# EAGLE design Lock-In (EAGLE 7.5.0)
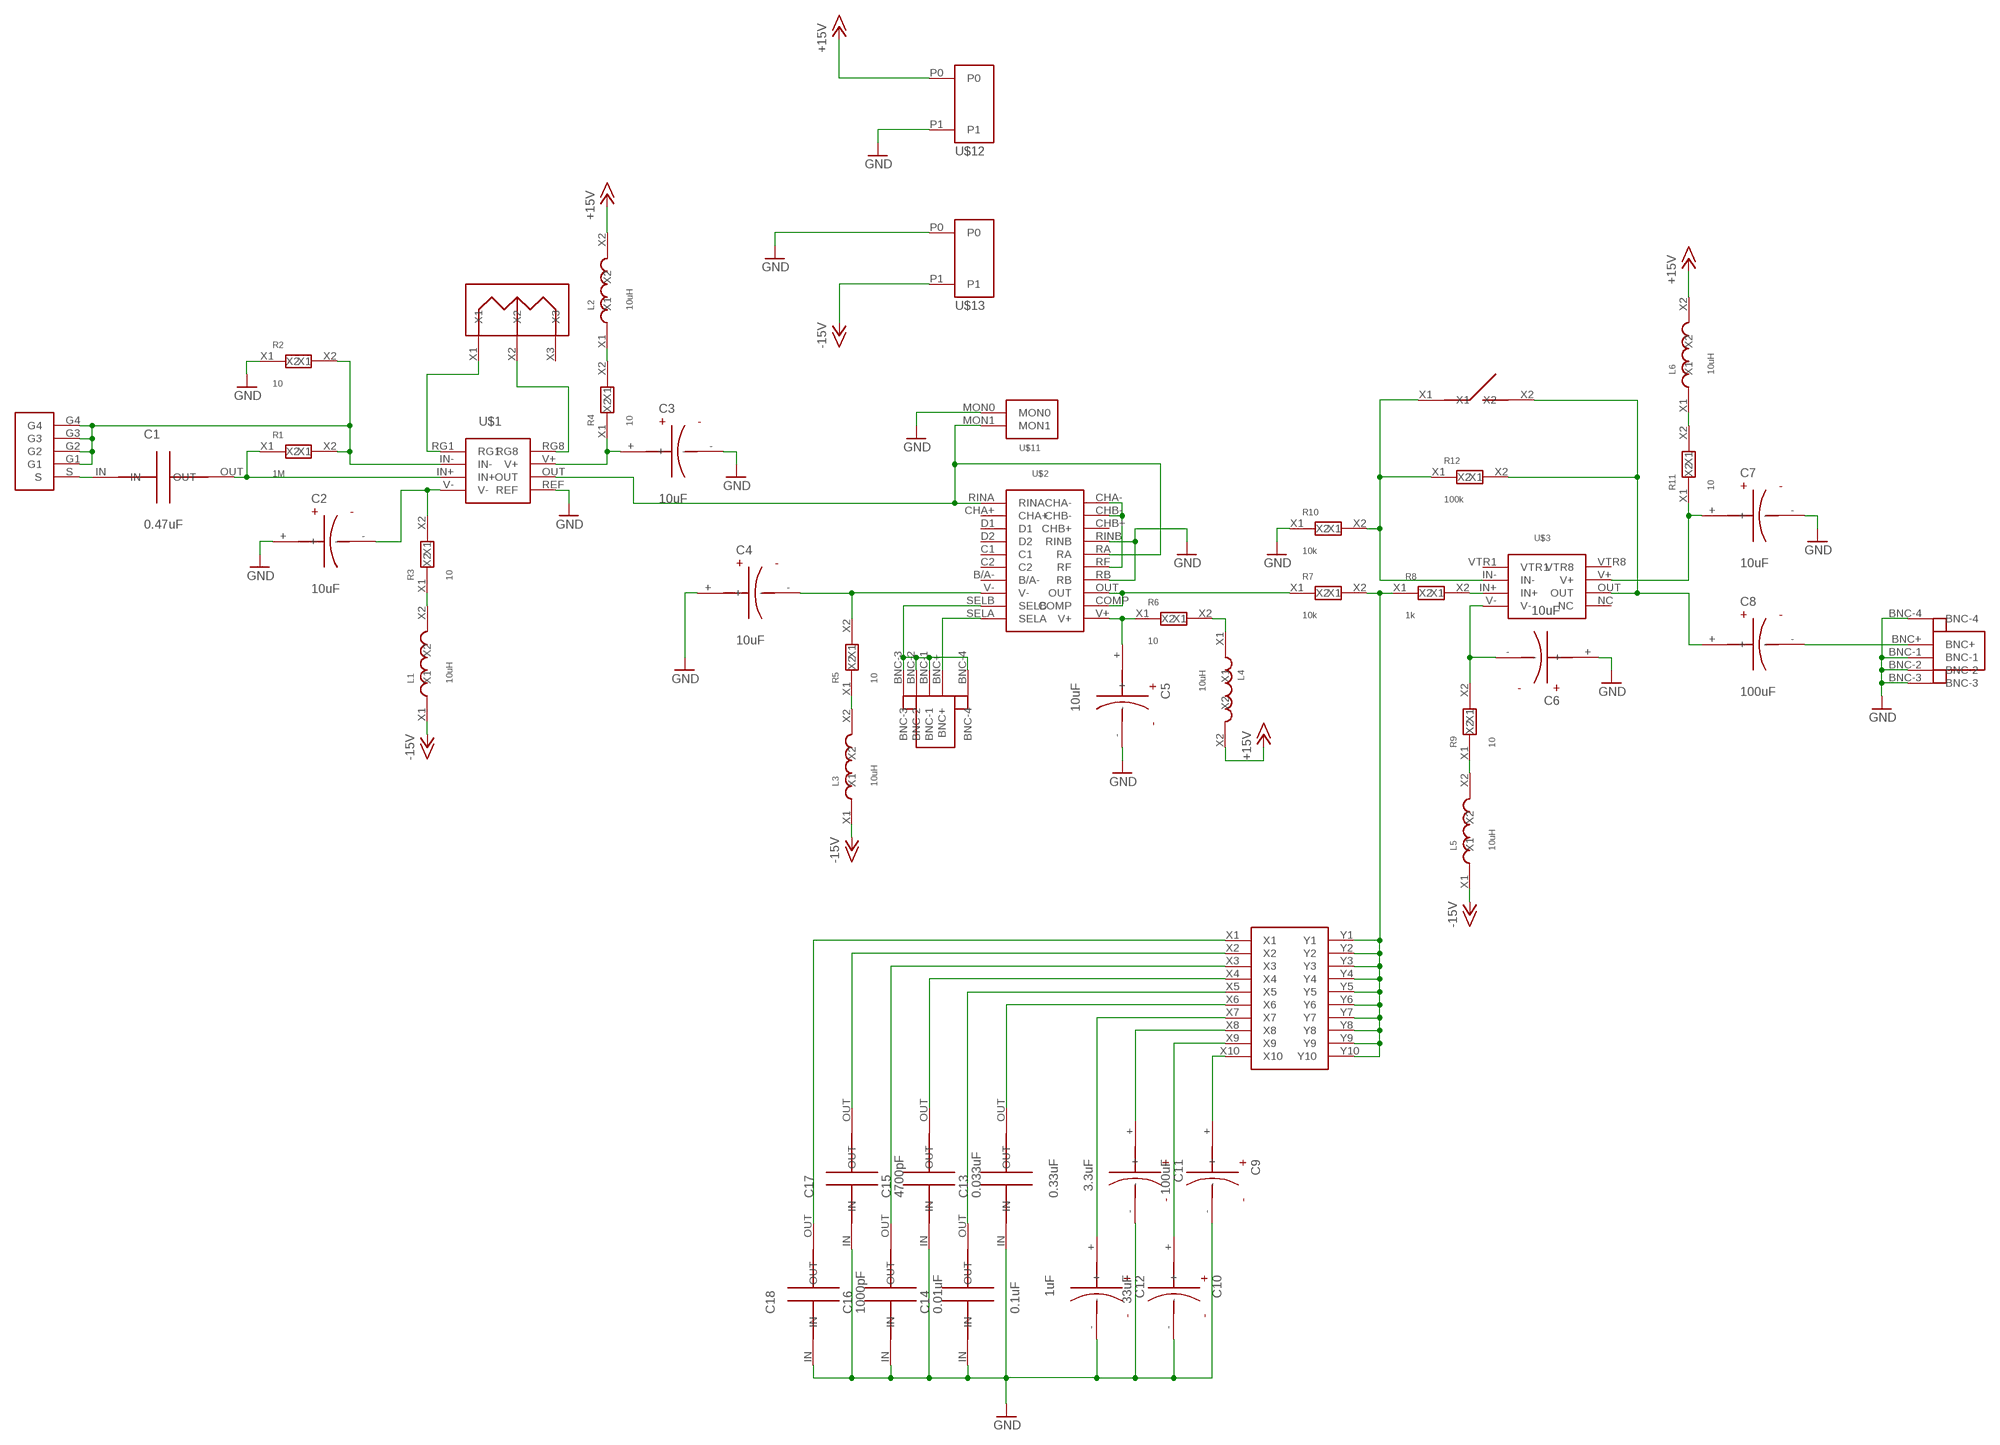
[diagram p0: schematic, sheet 1]

## Parts
C1  0.47uF  C_CER_5MM  [C_CER_5MM]
C2  10uF  C_ELT_2MM  [C_ELT_2MM]
C3  10uF  C_ELT_2MM  [C_ELT_2MM]
C4  10uF  C_ELT_2MM  [C_ELT_2MM]
C5  10uF  C_ELT_2MM  [C_ELT_2MM]
C6  10uF  C_ELT_2MM  [C_ELT_2MM]
C7  10uF  C_ELT_2MM  [C_ELT_2MM]
C8  100uF  C_ELT_2MM  [C_ELT_2MM]
C9  100uF  C_ELT_2MM  [C_ELT_2MM]
C10  33uF  C_ELT_2MM  [C_ELT_2MM]
C11  3.3uF  C_ELT_2MM  [C_ELT_2MM]
C12  1uF  C_ELT_2MM  [C_ELT_2MM]
C13  0.33uF  C_CER_5MM  [C_CER_5MM]
C14  0.1uF  C_CER_5MM  [C_CER_5MM]
C15  0.033uF  C_CER_5MM  [C_CER_5MM]
C16  0.01uF  C_CER_5MM  [C_CER_5MM]
C17  4700pF  C_CER_5MM  [C_CER_5MM]
C18  1000pF  C_CER_5MM  [C_CER_5MM]
L1  10uH  L_10X3  [L_10X3]
L2  10uH  L_10X3  [L_10X3]
L3  10uH  L_10X3  [L_10X3]
L4  10uH  L_10X3  [L_10X3]
L5  10uH  L_10X3  [L_10X3]
L6  10uH  L_10X3  [L_10X3]
R1  1M  R_6X2  [R_6X2]
R2  10  R_6X2  [R_6X2]
R3  10  R_6X2  [R_6X2]
R4  10  R_6X2  [R_6X2]
R5  10  R_6X2  [R_6X2]
R6  10  R_6X2  [R_6X2]
R7  10k  R_6X2  [R_6X2]
R8  1k  R_6X2  [R_6X2]
R9  10  R_6X2  [R_6X2]
R10  10k  R_6X2  [R_6X2]
R11  10  R_6X2  [R_6X2]
R12  100k  R_6X2  [R_6X2]
U$1  AD620N  [AD620N]
U$2  AD630  [AD630]
U$3  OP27  [OP27]
U$4  BNC  [BNC]
U$5  BNC  [BNC]
U$6  DIP10  [DIP10]
U$7  R_VAR_10K  [R_VAR_10K]
U$8  SMA_AN  [SMA_AN]
U$9  DIP_1  [DIP_1]
U$11  MON2PIN  [MON2PIN]
U$12  RAIL_2  [RAIL_2]
U$13  RAIL_2  [RAIL_2]

## Nets
+15V: L2.X2 L4.X2 L6.X2 U$12.P0
-15V: L1.X1 L3.X1 L5.X1 U$13.P1
GND: C2.+ C3.- C4.+ C5.- C6.+ C7.- C9.- C10.- C11.- C12.- C13.IN C14.IN C15.IN C16.IN C17.IN C18.IN R2.X1 R10.X1 U$1.REF U$2.RB U$2.RINB U$5.BNC-1 U$5.BNC-2 U$5.BNC-3 U$5.BNC-4 U$11.MON0 U$12.P1 U$13.P0
N$1: C1.IN U$8.S
N$2: R1.X2 R2.X2 U$1.IN- U$8.G1 U$8.G2 U$8.G3 U$8.G4
N$3: C1.OUT R1.X1 U$1.IN+
N$5: L1.X2 R3.X1
N$6: C2.- R3.X2 U$1.V-
N$7: C3.+ R4.X1 U$1.V+
N$8: U$1.RG1 U$7.X1
N$9: U$1.RG8 U$7.X2
N$10: L2.X1 R4.X2
N$11: U$1.OUT U$2.RA U$2.RINA U$11.MON1
N$12: R7.X1 U$2.COMP U$2.OUT
N$13: U$2.CHA- U$2.CHB- U$2.RF
N$14: U$2.SELA U$4.BNC+
N$15: U$2.SELB U$4.BNC-1 U$4.BNC-2 U$4.BNC-3 U$4.BNC-4
N$16: C5.+ R6.X1 U$2.V+
N$17: L4.X1 R6.X2
N$18: L3.X2 R5.X1
N$19: C4.- R5.X2 U$2.V-
N$20: R7.X2 R8.X1 U$6.Y1 U$6.Y2 U$6.Y3 U$6.Y4 U$6.Y5 U$6.Y6 U$6.Y7 U$6.Y8 U$6.Y9 U$6.Y10
N$21: R8.X2 U$3.IN+
N$22: L5.X2 R9.X1
N$23: C6.- R9.X2 U$3.V-
N$24: R10.X2 R12.X1 U$3.IN- U$9.X1
N$25: C7.+ R11.X1 U$3.V+
N$26: L6.X1 R11.X2
N$27: C8.+ R12.X2 U$3.OUT U$9.X2
N$28: C8.- U$5.BNC+
N$29: C9.+ U$6.X10
N$30: C10.+ U$6.X9
N$31: C11.+ U$6.X8
N$32: C12.+ U$6.X7
N$34: C13.OUT U$6.X6
N$35: C14.OUT U$6.X5
N$36: C15.OUT U$6.X4
N$37: C16.OUT U$6.X3
N$38: C17.OUT U$6.X2
N$39: C18.OUT U$6.X1
Unconnected: U$2.B/A- U$2.C1 U$2.C2 U$2.CHA+ U$2.CHB+ U$2.D1 U$2.D2 U$3.NC U$3.VTR1 U$3.VTR8 U$7.X3

## Library data of the parts
C1 C13-C18 = MyDuino:C_CER_5MM
C2-C12 = MyDuino:C_ELT_2MM
L1-L6 = MyDuino:L_10X3
R1-R12 = MyDuino:R_6X2
U$1 = MyLockIn:AD620N
U$2 = MyLockIn:AD630
U$3 = MyLockIn:OP27
U$4 U$5 = MyLockIn:BNC
U$6 = MyLockIn:DIP10
U$7 = MyLockIn:R_VAR_10K
U$8 = My_OPT:SMA_AN
U$9 = My_STM32L15x:DIP_1
U$11 = MyCMOSsensor:MON2PIN
U$12 U$13 = My_HV_Components:RAIL_2

## Board
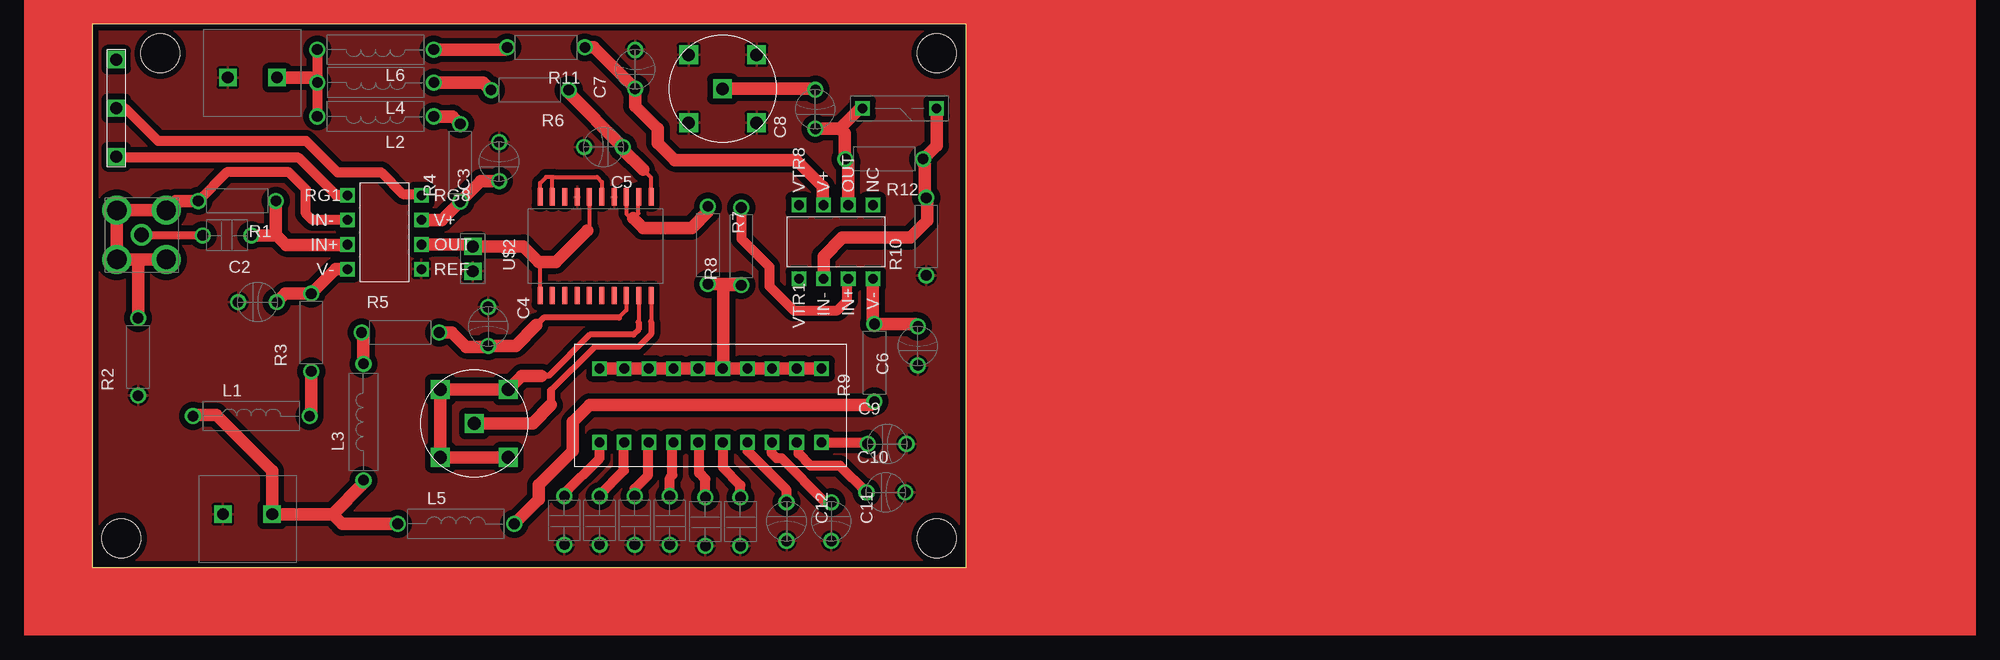
[diagram p1: board, top side]
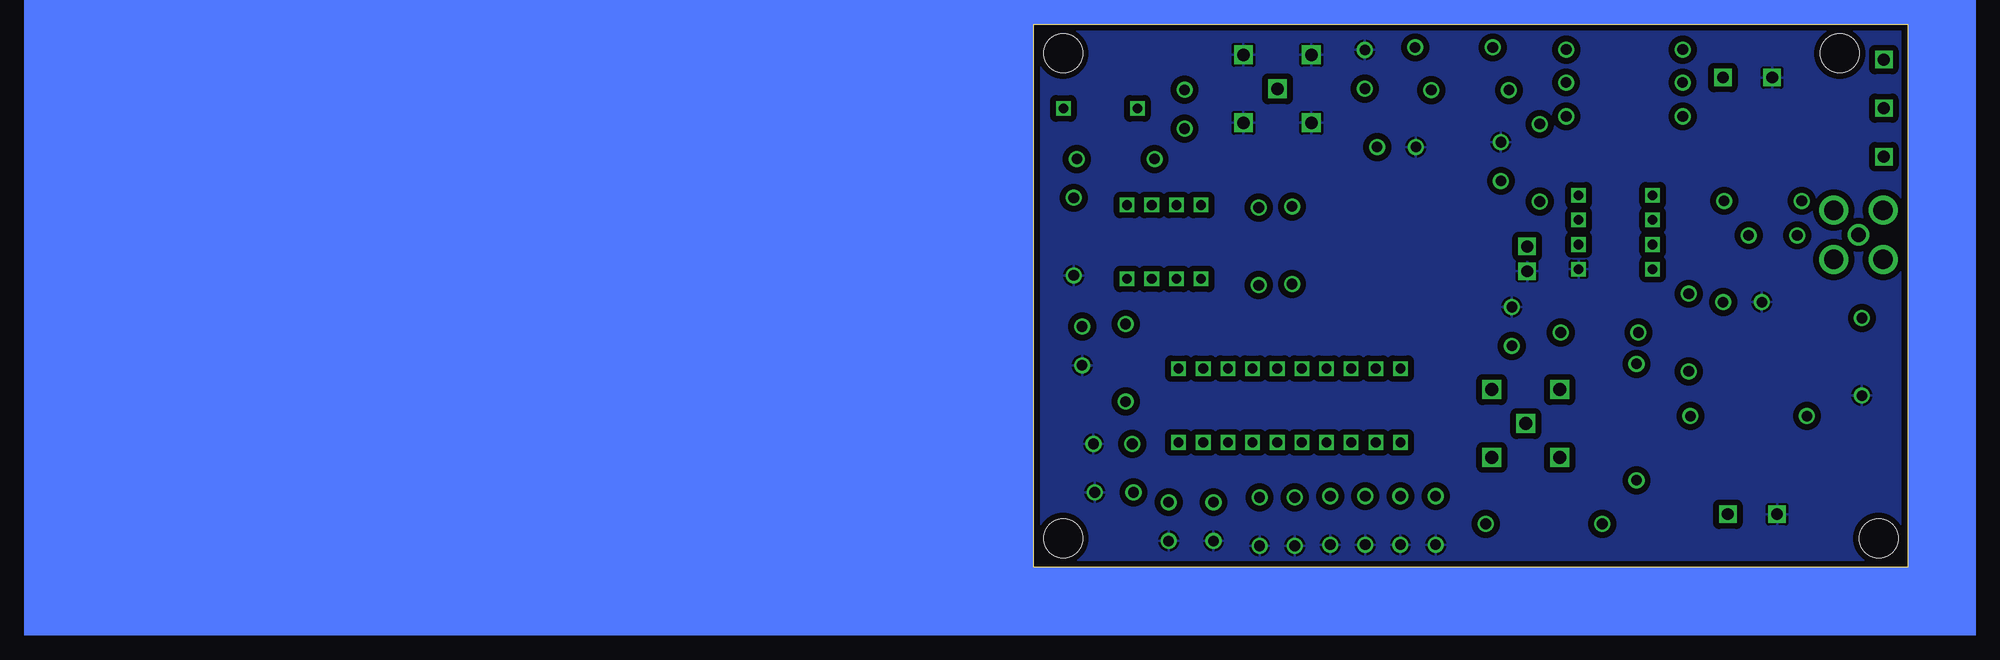
[diagram p2: board, bottom side, seen from below]

Size 90 x 56 mm. Coordinates in mm from the lower left corner, seen from the top.
Outline: 0,0 90,0 90,56 0,56 0,0
Copper layers (1*16): Top 0.035mm / dielectric 1.5mm / Bottom 0.035mm
Design rules "default *": minimum track width 10mil, minimum drill 24mil, track to track 8mil, track to pad 8mil, pad to pad 8mil, via to via 8mil, smd to smd 8mil, copper to edge 10mil, drill to drill 8mil, minimum pad ring 10mil, minimum via ring 8mil, stop-mask expansion 4mil, vias tented up to drill 0mil, thermal gap 10mil
Holes 4 mm at 7,53 87,53 87,3 3,3

### Footprints (pad centres in the part's own frame; a part is rotated, then mirrored left to right if it is on the bottom)
C_CER_5MM = drill 1.1: IN -2.5,0; OUT 2.5,0
C_ELT_2MM = drill 1.1: + -2,0; - 2,0
L_10X3 = drill 1.1: X1 -6,0; X2 6,0
R_6X2 = drill 1.1: X1 -4,0; X2 4,0
AD620N = drill 1 square: IN+ -5.08,0; IN- -5.08,2.54; OUT 2.54,0; REF 2.54,-2.54; RG1 -5.08,5.08; RG8 2.54,5.08; V+ 2.54,2.54; V- -5.08,-2.54
AD630 = smd 1.778 x 0.508: B/A- -5.08,-1.27; C1 -5.08,1.27; C2 -5.08,0; CHA+ -5.08,5.08; CHA- 5.08,6.35; CHB+ 5.08,3.81; CHB- 5.08,5.08; COMP 5.08,-3.81; D1 -5.08,3.81; D2 -5.08,2.54; OUT 5.08,-2.54; RA 5.08,1.27; RB 5.08,-1.27; RF 5.08,0; RINA -5.08,6.35; RINB 5.08,2.54; SELA -5.08,-5.08; SELB -5.08,-3.81; V+ 5.08,-5.08; V- -5.08,-2.54
OP27 = drill 1 square: IN+ -2.54,0; IN- -2.54,2.54; NC 5.08,-2.54; OUT 5.08,0; V+ 5.08,2.54; V- -2.54,-2.54; VTR1 -2.54,5.08; VTR8 5.08,5.08
BNC = drill 1.3 square: BNC+ 0,0; BNC-1 -3.5,3.5; BNC-2 3.5,3.5; BNC-3 3.5,-3.5; BNC-4 -3.5,-3.5
DIP10 = drill 1 square: X1 -5.08,12.7; X2 -5.08,10.16; X3 -5.08,7.62; X4 -5.08,5.08; X5 -5.08,2.54; X6 -5.08,0; X7 -5.08,-2.54; X8 -5.08,-5.08; X9 -5.08,-7.62; X10 -5.08,-10.16; Y1 2.54,12.7; Y2 2.54,10.16; Y3 2.54,7.62; Y4 2.54,5.08; Y5 2.54,2.54; Y6 2.54,0; Y7 2.54,-2.54; Y8 2.54,-5.08; Y9 2.54,-7.62; Y10 2.54,-10.16
R_VAR_10K = drill 1.2 square: X1 0,5; X2 0,0; X3 0,-5
SMA_AN = drill 2: G1 -2.54,2.54; G2 2.54,2.54; G3 2.54,-2.54; G4 -2.54,-2.54 | drill 1.5: S 0,0
DIP_1 = drill 1 square: X1 0,2.54; X2 0,-5.08
MON2PIN = drill 1.2 square: MON0 0,2.54; MON1 0,0
RAIL_2 = drill 1.2 square: P0 0,2.54; P1 0,-2.54

### Placement (x,y rotation side)
C1  13.89,34.24 0 top
C2  17.02,27.35 0 top
C3  41.9,41.85 90 top
C4  40.78,24.85 270 top
C5  52.66,43.35 180 top
C6  85.04,22.85 90 top
C7  55.92,51.35 90 top
C8  74.49,47.24 90 top
C9  81.87,12.74 0 top
C10  81.75,7.74 0 top
C11  76.13,4.74 270 top
C12  71.51,4.74 270 top
C13  66.77,4.74 90 top
C14  63.15,4.74 90 top
C15  59.49,4.86 90 top
C16  55.87,4.86 90 top
C17  52.25,4.86 90 top
C18  48.63,4.86 90 top
L1  16.38,15.61 0 top
L2  29.18,46.5 180 top
L3  27.94,15 90 top
L4  29.2,50 180 top
L5  37.46,4.5 0 top
L6  29.18,53.39 180 top
R1  14.92,37.79 180 top
R2  4.72,21.72 90 top
R3  22.56,24.22 90 top
R4  37.9,41.72 90 top
R5  31.74,24.22 0 top
R6  45.08,49.22 180 top
R7  63.42,33.22 270 top
R8  66.86,33.11 90 top
R9  80.56,21.11 90 top
R10  85.9,34.11 90 top
R11  46.74,53.61 180 top
R12  81.58,42.11 180 top
U$1  31.36,33.29 0 top
U$2  52.48,33.12 90 top
U$3  77.87,32.29 90 top
U$4  39.35,14.85 0 top
U$5  64.92,49.35 0 top
U$6  64.95,17.97 90 top
U$7  2.47,47.35 180 top
U$8  5.08,34.29 0 top
U$9  84.43,47.33 270 top
U$11  39.2,33.09 180 top
U$12  16.5,50.5 270 top
U$13  16,5.5 90 top

### Tracks (layer width: path | path; a pad name or v marks a point on that pad's centre or on a via)
+15V
  Top 1.016: L6.X2 23.18,50.02 L4.X2 23.2,46.52 L2.X2
  Top 1.27: U$12.P0 22.7,50.5 L4.X2
-15V
  Top 1.27: L1.X1 10.52,15.75 12.75,15.75 18.54,9.96 U$13.P1 24.75,5.5 | L3.X1 27.94,8.69 24.75,5.5 | L5.X1 25.75,4.5 24.75,5.5
GND
  pour Bottom (isolate 0.61): 0,56 90,56 90,0 0,0
  pour Top (isolate 0.61): 0,56 90,56 90,0 0,0
N$1
  Top 0.813: U$8.S 11.34,34.29 C1.IN
N$2
  Top 1.016: U$1.IN- 22.67,35.83 22,36.5 22,39 20.25,40.75 13.88,40.75 R1.X2
  Top 1.27: 5,31.75 U$8.G3 | 5,31.75 U$8.G4 U$8.G1 U$8.G2 8.58,37.79 R1.X2 | R2.X2 4.72,31.47 5,31.75
N$3
  Top 1.27: 19.01,34.24 C1.OUT | 19.01,34.24 20,33.25 26.24,33.25 U$1.IN+ | R1.X1 18.92,34.33 19.01,34.24
N$5
  Top 1.27: R3.X1 22.56,15.79 L1.X2
N$6
  Top 1.27: U$1.V- 25.09,30.75 R3.X2 19.89,28.22 C2.-
N$7
  Top 1.27: U$1.V+ 36.01,35.83 R4.X1 40.03,39.85 C3.+
N$8
  Top 1.016: U$1.RG1 25.13,38.37 21.25,42.25 2.57,42.25 U$7.X1
N$9
  Top 1.016: U$7.X2 3.4,47.35 6.75,44 22,44 25.25,40.75 29.75,40.75 32,38.5 33.77,38.5 U$1.RG8
N$10
  Top 1.27: L2.X1 37.12,46.5 R4.X2
N$11
  Top 0.406: U$2.RINA 46.13,31.37 46,31.5 | U$2.RA 51.21,34.96 51,34.75
  Top 1.27: U$1.OUT 39,33.29 U$11.MON1 44.41,33.09 46,31.5 47.75,31.5 51,34.75
N$12
  Top 0.406: U$2.OUT 55.02,36.48 55.5,36 55.75,36 56.25,36.5 56.25,38.16 U$2.COMP
  Top 1.27: R7.X1 63.42,36.67 61.75,35 56.75,35 55.75,36
N$13
  Top 0.406: U$2.CHA- 46.13,39.63 46.75,40.25 47.5,40.25 | 47.5,40.25 52,40.25 52.5,39.75 52.5,38.22 U$2.RF | U$2.CHB- 47.4,40.15 47.5,40.25
N$14
  Top 0.406: U$2.SELA 57.56,25.31 57.5,25.25
  Top 0.61: 57.56,25.31 57.56,24.06 56.25,22.75 51.75,22.75 47.25,18.25
  Top 0.813: 47.25,18.25 47.25,16.75
  Top 1.27: U$4.BNC+ 45.35,14.85 47.25,16.75
N$15
  Top 0.406: U$2.SELB 56.29,25.29 56.25,25.25
  Top 0.61: 56.29,25.29 56.29,24.54 55.75,24 51.25,24 47,19.75 46.25,19.75
  Top 1.27: U$4.BNC-3 U$4.BNC-4 U$4.BNC-1 U$4.BNC-2 44.25,19.75 46.25,19.75
N$16
  Top 0.406: U$2.V+ 57.56,40.19 56.75,41
  Top 1.27: R6.X1 49.08,48.93 C5.+ 54.66,43.09 56.75,41
N$17
  Top 1.27: L4.X1 40.3,50 R6.X2
N$18
  Top 1.27: L3.X2 27.94,24.02 R5.X1
N$19
  Top 0.406: U$2.V- 55.02,26.52 54.25,25.75
  Top 0.61: 54.25,25.75 46.5,25.75 45.75,25
  Top 1.27: R5.X2 37.03,24.22 38.5,22.75 40.68,22.75 C4.- 43.6,22.85 45.75,25
N$20
  Top 1.27: U$6.Y1 U$6.Y2 U$6.Y3 U$6.Y4 U$6.Y5 U$6.Y6 | U$6.Y6 U$6.Y7 U$6.Y8 U$6.Y9 U$6.Y10 | R7.X2 65,29.22 | 65,29.22 66.75,29.22 R8.X1 65.11,29.11 65,29.22 | 65,29.22 65,20.56 U$6.Y6
N$21
  Top 1.016: R8.X2 66.86,33.9 69.75,31 69.75,29 72.25,26.5 76.75,26.5 77.75,27.5 77.75,29.63 U$3.IN+
N$22
  Top 1.27: R9.X1 80.2,16.75 51.25,16.75 49.5,15 49.5,12 46,8.5 46,7.04 L5.X2
N$23
  Top 1.27: U$3.V- 80.41,25.26 R9.X2 84.78,25.11 C6.-
N$24
  Top 1.27: U$3.IN- 75.33,32.08 77.25,34 84.25,34 86,35.75 86,38.01 R10.X2 85.75,38.26 85.75,41.5 85.58,41.67 R12.X1 85.61,42.11 87,43.5 87,47.3 U$9.X1
N$25
  Top 1.27: R11.X1 51.66,53.61 C7.+ 55.92,47.58 58.25,45.25 58.25,43.75 60,42 72.5,42 75.25,39.25 75.25,37.45 U$3.V+
N$26
  Top 1.27: L6.X1 42.52,53.39 R11.X2
N$27
  Top 1.27: U$3.OUT 77.87,41.82 R12.X2 77.5,42.19 77.5,44.75 77.01,45.24 | 77.01,45.24 C8.+ | U$9.X2 79.1,47.33 77.01,45.24
N$28
  Top 1.27: U$5.BNC+ 74.38,49.35 C8.-
N$29
  Top 1.016: U$6.X10 79.72,12.89 C9.+
N$30
  Top 1.016: C10.+ 77,10.5 74,10.5 72.75,11.75 72.75,12.71 U$6.X9
N$31
  Top 1.016: C11.+ 75.51,6.74 71,11.25 70.5,11.25 70,11.75 70,12.86 U$6.X8
N$32
  Top 1.016: C12.+ 71.51,7.99 67.5,12 U$6.X7
N$34
  Top 1.016: C13.OUT 66.77,8.48 65,10.25 65,12.84 U$6.X6
N$35
  Top 1.016: C14.OUT 63.15,9.1 62.5,9.75 62.5,12.8 U$6.X5
N$36
  Top 1.016: C15.OUT 59.49,9.24 59.75,9.5 59.75,12.77 U$6.X4
N$37
  Top 1.016: C16.OUT 55.87,8.12 57.25,9.5 57.25,12.81 U$6.X3
N$38
  Top 1.016: C17.OUT 52.25,7.5 54.75,10 54.75,12.85 U$6.X2
N$39
  Top 1.016: C18.OUT 48.63,7.63 52.25,11.25 U$6.X1
(copper drawn outside any net)
  shapes: Bottom area x5, Top area x4